# Altium project Timer.PrjPcb
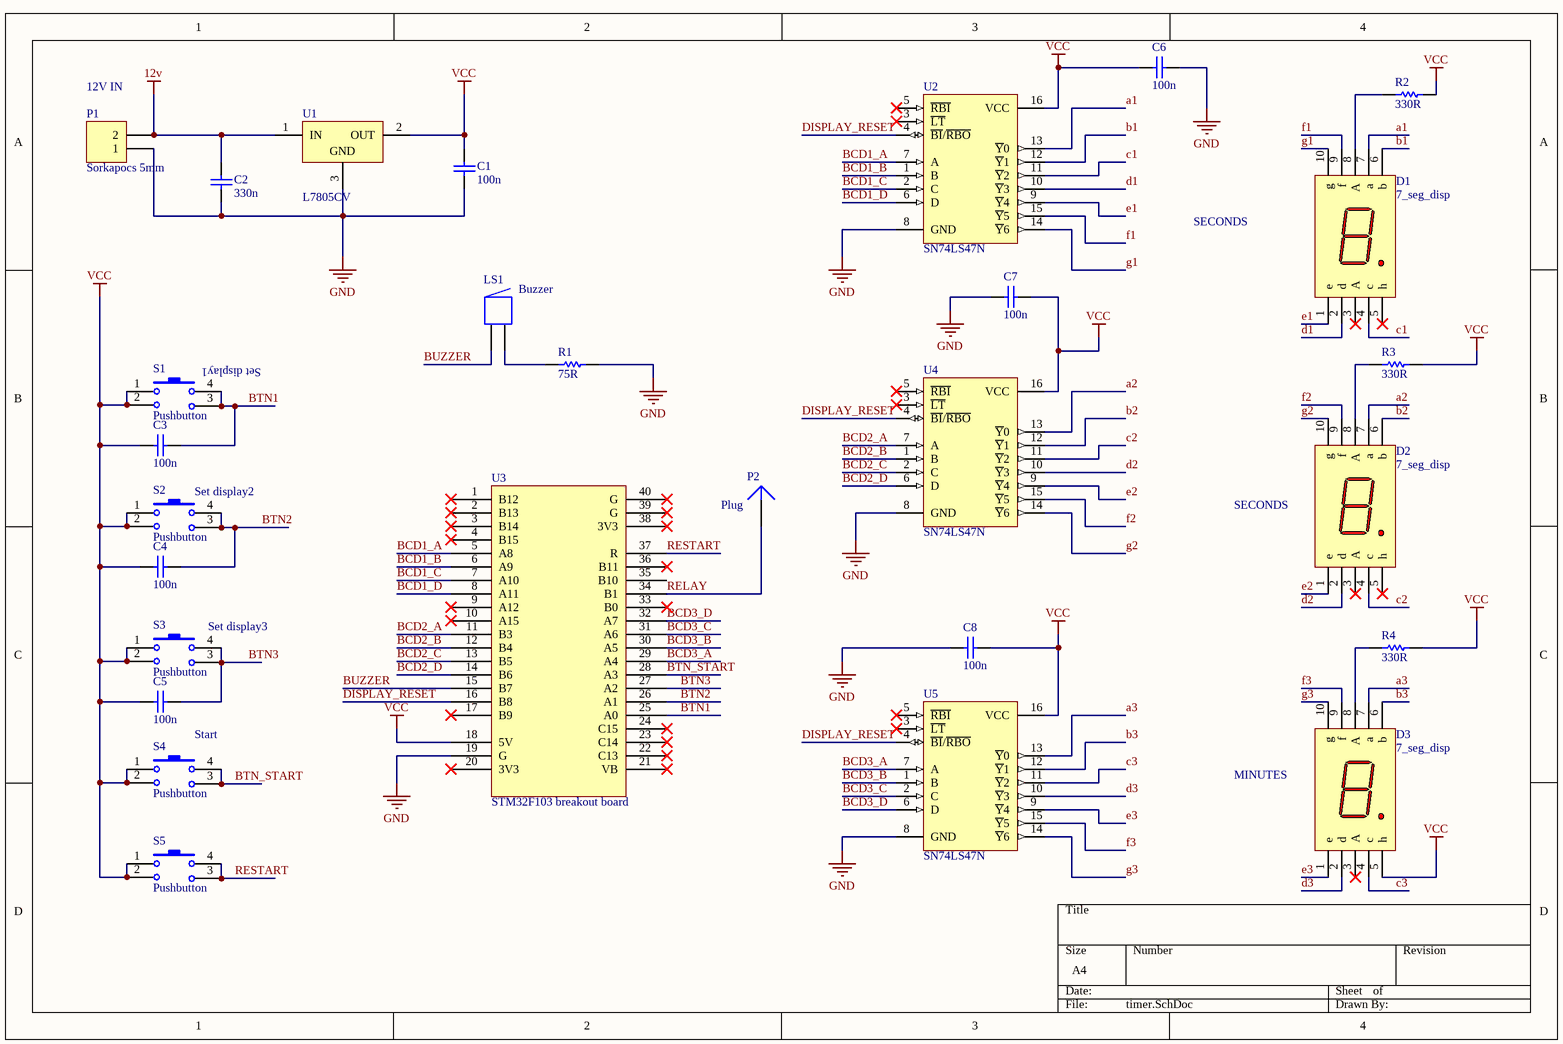
[diagram p0: timer.SchDoc]
1 sheet, 28 parts. Net scope: global (net labels, ports and power ports of the same name join across sheets).
Board file: Timer.PcbDoc

## Sheet timer.SchDoc
size A4

### Parts
C1  100n  [cap 100mil]
C2  330n  [cap 5mm]
C3  100n  [cap 100mil]
C4  100n  [cap 100mil]
C5  100n  [cap 100mil]
C6  100n  [cap 100mil]
C7  100n  [cap 100mil]
C8  100n  [cap 100mil]
D1  7_seg_disp  [Seven segment display]
D2  7_seg_disp  [Seven segment display]
D3  7_seg_disp  [Seven segment display]
LS1  Buzzer  [Buzzer]
P1  Sorkapocs 5mm  [SORKAPOCS-2]
P2  Plug  [pad]
R1  75R  [AXIAL-0.4]
R2  330R  [AXIAL-0.4]
R3  330R  [AXIAL-0.4]
R4  330R  [AXIAL-0.4]
S1  Pushbutton  [Pushbutton]
S2  Pushbutton  [Pushbutton]
S3  Pushbutton  [Pushbutton]
S4  Pushbutton  [Pushbutton]
S5  Pushbutton  [Pushbutton]
U1  L7805CV  [TO220ABN]
U2  SN74LS47N  [648-08]
U3  STM32F103 breakout board  [STM32 BLUE PILL]
U4  SN74LS47N  [648-08]
U5  SN74LS47N  [648-08]

### Nets
12v: C2.2 P1.2 U1.1(IN)
GND: C1.1 C2.1 C6.1 C7.2 C8.2 P1.1 R1.2 U1.3(GND) U2.8(GND) U3.19(G) U4.8(GND) U5.8(GND)
VCC: C1.2 C3.2 C4.2 C5.2 C6.2 C7.1 C8.1 D3.5(h) R2.2 R3.2 R4.2 S1.1 S1.2 S2.1 S2.2 S3.1 S3.2 S4.1 S4.2 S5.1 S5.2 U1.2(OUT) U2.16(VCC) U3.18(5V) U4.16(VCC) U5.16(VCC)
a1: D1.7(a) U2.13(~{Y}0)
a2: D2.7(a) U4.13(~{Y}0)
a3: D3.7(a) U5.13(~{Y}0)
b1: D1.6(b) U2.12(~{Y}1)
b2: D2.6(b) U4.12(~{Y}1)
b3: D3.6(b) U5.12(~{Y}1)
BCD1_A: U2.7(A) U3.5(A8)
BCD1_B: U2.1(B) U3.6(A9)
BCD1_C: U2.2(C) U3.7(A10)
BCD1_D: U2.6(D) U3.8(A11)
BCD2_A: U3.11(B3) U4.7(A)
BCD2_B: U3.12(B4) U4.1(B)
BCD2_C: U3.13(B5) U4.2(C)
BCD2_D: U3.14(B6) U4.6(D)
BCD3_A: U3.29(A4) U5.7(A)
BCD3_B: U3.30(A5) U5.1(B)
BCD3_C: U3.31(A6) U5.2(C)
BCD3_D: U3.32(A7) U5.6(D)
BTN1: C3.1 S1.3 S1.4 U3.25(A0)
BTN2: C4.1 S2.3 S2.4 U3.26(A1)
BTN3: C5.1 S3.3 S3.4 U3.27(A2)
BTN_START: S4.3 S4.4 U3.28(A3)
BUZZER: LS1.1 U3.15(B7)
c1: D1.4(c) U2.11(~{Y}2)
c2: D2.4(c) U4.11(~{Y}2)
c3: D3.4(c) U5.11(~{Y}2)
d1: D1.2(d) U2.10(~{Y}3)
d2: D2.2(d) U4.10(~{Y}3)
d3: D3.2(d) U5.10(~{Y}3)
DISPLAY_RESET: U2.4(~{BI}/~{RBO}) U3.16(B8) U4.4(~{BI}/~{RBO}) U5.4(~{BI}/~{RBO})
e1: D1.1(e) U2.9(~{Y}4)
e2: D2.1(e) U4.9(~{Y}4)
e3: D3.1(e) U5.9(~{Y}4)
f1: D1.9(f) U2.15(~{Y}5)
f2: D2.9(f) U4.15(~{Y}5)
f3: D3.9(f) U5.15(~{Y}5)
g1: D1.10(g) U2.14(~{Y}6)
g2: D2.10(g) U4.14(~{Y}6)
g3: D3.10(g) U5.14(~{Y}6)
RELAY: P2.1 U3.34(B1)
RESTART: S5.3 S5.4 U3.37(R)
NetD1_8: D1.8(A) R2.1
NetD2_8: D2.8(A) R3.1
NetD3_8: D3.8(A) R4.1
NetLS1_2: LS1.2 R1.1

Not connected (* = marked no-connect by the designer): D1 3(A)* 5(h)*; D2 3(A)* 5(h)*; D3 3(A)*; U2 3(~{LT})* 5(~{RBI})*; U3 1(B12)* 2(B13)* 3(B14)* 4(B15)* 9(A12)* 10(A15)* 17(B9)* 20(3V3)* 21(VB)* 22(C13)* 23(C14)* 24(C15)* 33(B0)* 35(B10) 36(B11)* 38(3V3)* 39(G)* 40(G)*; U4 3(~{LT})* 5(~{RBI})*; U5 3(~{LT})* 5(~{RBI})*

### Notes on the sheet
- (near P1) 12V IN
- SECONDS
- (near S1) Set display1
- (near S2) Set display2
- (near D2) SECONDS
- (near S3) Set display3
- Start
- (near D3) MINUTES

### Library data of the parts
C1-C8 = Cap: Capacitor; Value: 100pF; Published: 8-Jun-2000; LatestRevisionDate: 17-Jul-2002; LatestRevisionNote: Re-released for DXP Platform.; PackageReference: RAD-0.3; Publisher: Altium Limited; PackageDescription: Radial Cap, Thru-Hole; 2 Leads; 0.3 in Pin Spacing
LS1 = Buzzer: Magnetic Transducer Buzzer; Published: 24-Mar-1999; LatestRevisionDate: 17-Dec-2003; LatestRevisionNote: Schematic revised, PCB Footprint replaced.; DatasheetVersion: 17-Dec-2003; PackageReference: ABSM-1574; Publisher: Altium Limited; PackageDescription: Magnetic Transducer Buzzer; ComponentLink1Description: Manufacturer Link; ComponentLink1URL: http://www.megastar.com/linecard/buzzmode/index.php
P1 = Header 2: Header, 2-Pin; LatestRevisionDate: 17-Jul-2002; LatestRevisionNote: Re-released for DXP Platform.; Publisher: Altium Limited
R1-R4 = Res1: Resistor; Value: 1K; Published: 8-Jun-2000; LatestRevisionDate: 17-Jul-2002; LatestRevisionNote: Re-released for DXP Platform.; PackageReference: AXIAL-0.3; Publisher: Altium Limited; PackageDescription: Axial Device, Thru-Hole; 2 Leads; 0.3 in Pin Spacing
S1-S5 = Tactile switch: FSM2JSMLS -  Tactile Switch, Illuminated, 24 V, 50 mA, 100 gf, SMD, FSMJSM Series; Mfr1: ALCOSWITCH - TE CONNECTIVITY; Mfr1 PN: FSM2JSMLS; ComponentLink1Description: Farnell; ComponentLink1URL: http://hu.farnell.com/te-connectivity-alcoswitch/fsm2jsmls/tactile-switch-spst-no-0-05a-24v/dp/2610948#anchorTechnicalDOCS; ComponentLink2Description: Datasheet; ComponentLink2URL: http://www.farnell.com/datasheets/2074943.pdf?_ga=2.199799912.731263013.1500916928-158472119.1495987916
U1 = L7805CV: Positive Voltage Regulator; Note: Tab is connected to pin 3 (GND).; Published: 24-Aug-2001; LatestRevisionDate: 17-Jul-2002; LatestRevisionNote: Re-released for DXP Platform.; DatasheetVersion: Dec-1998; PackageVersion: Jun-1998; PackageReference: TO220ABN; Publisher: Altium Limited; PackageDescription: TO, Thru-Hole, Vertical, Heatsink Mounted; 3 In-Line Leads; Pitch 2.54 mm; Pin sequence 1, 3, 2; ComponentLink1Description: Manufacturer Link; ComponentLink1URL: http://www.st.com/
U2 U4 U5 = SN74LS47N: BCD to 7-Segment Decoder/Driver; Published: 15-Apr-2002; DatasheetVersion: Dec-1999; PackageVersion: Apr-2000; PackageReference: 648-08; Publisher: Altium Limited; PackageDescription: DIP; 16 Leads; Row Spacing 7.62 mm; Pitch 2.54 mm; Code_JEDEC: MS-001-BB; ComponentLink1Description: Manufacturer Link; ComponentLink1URL: http://www.onsemi.com/; ComponentLink2Description: Datasheet; ComponentLink2URL: http://www.onsemi.com/pub/Collateral/SN74LS47-D.PDF
P2 = Plug: LatestRevisionDate: 17-Jul-2002; LatestRevisionNote: Re-released for DXP Platform.; Publisher: Altium Limited